# EAGLE schematic MEGA2560_Rev3e (EAGLE 9.3.0)

## Sheet 1 of 2
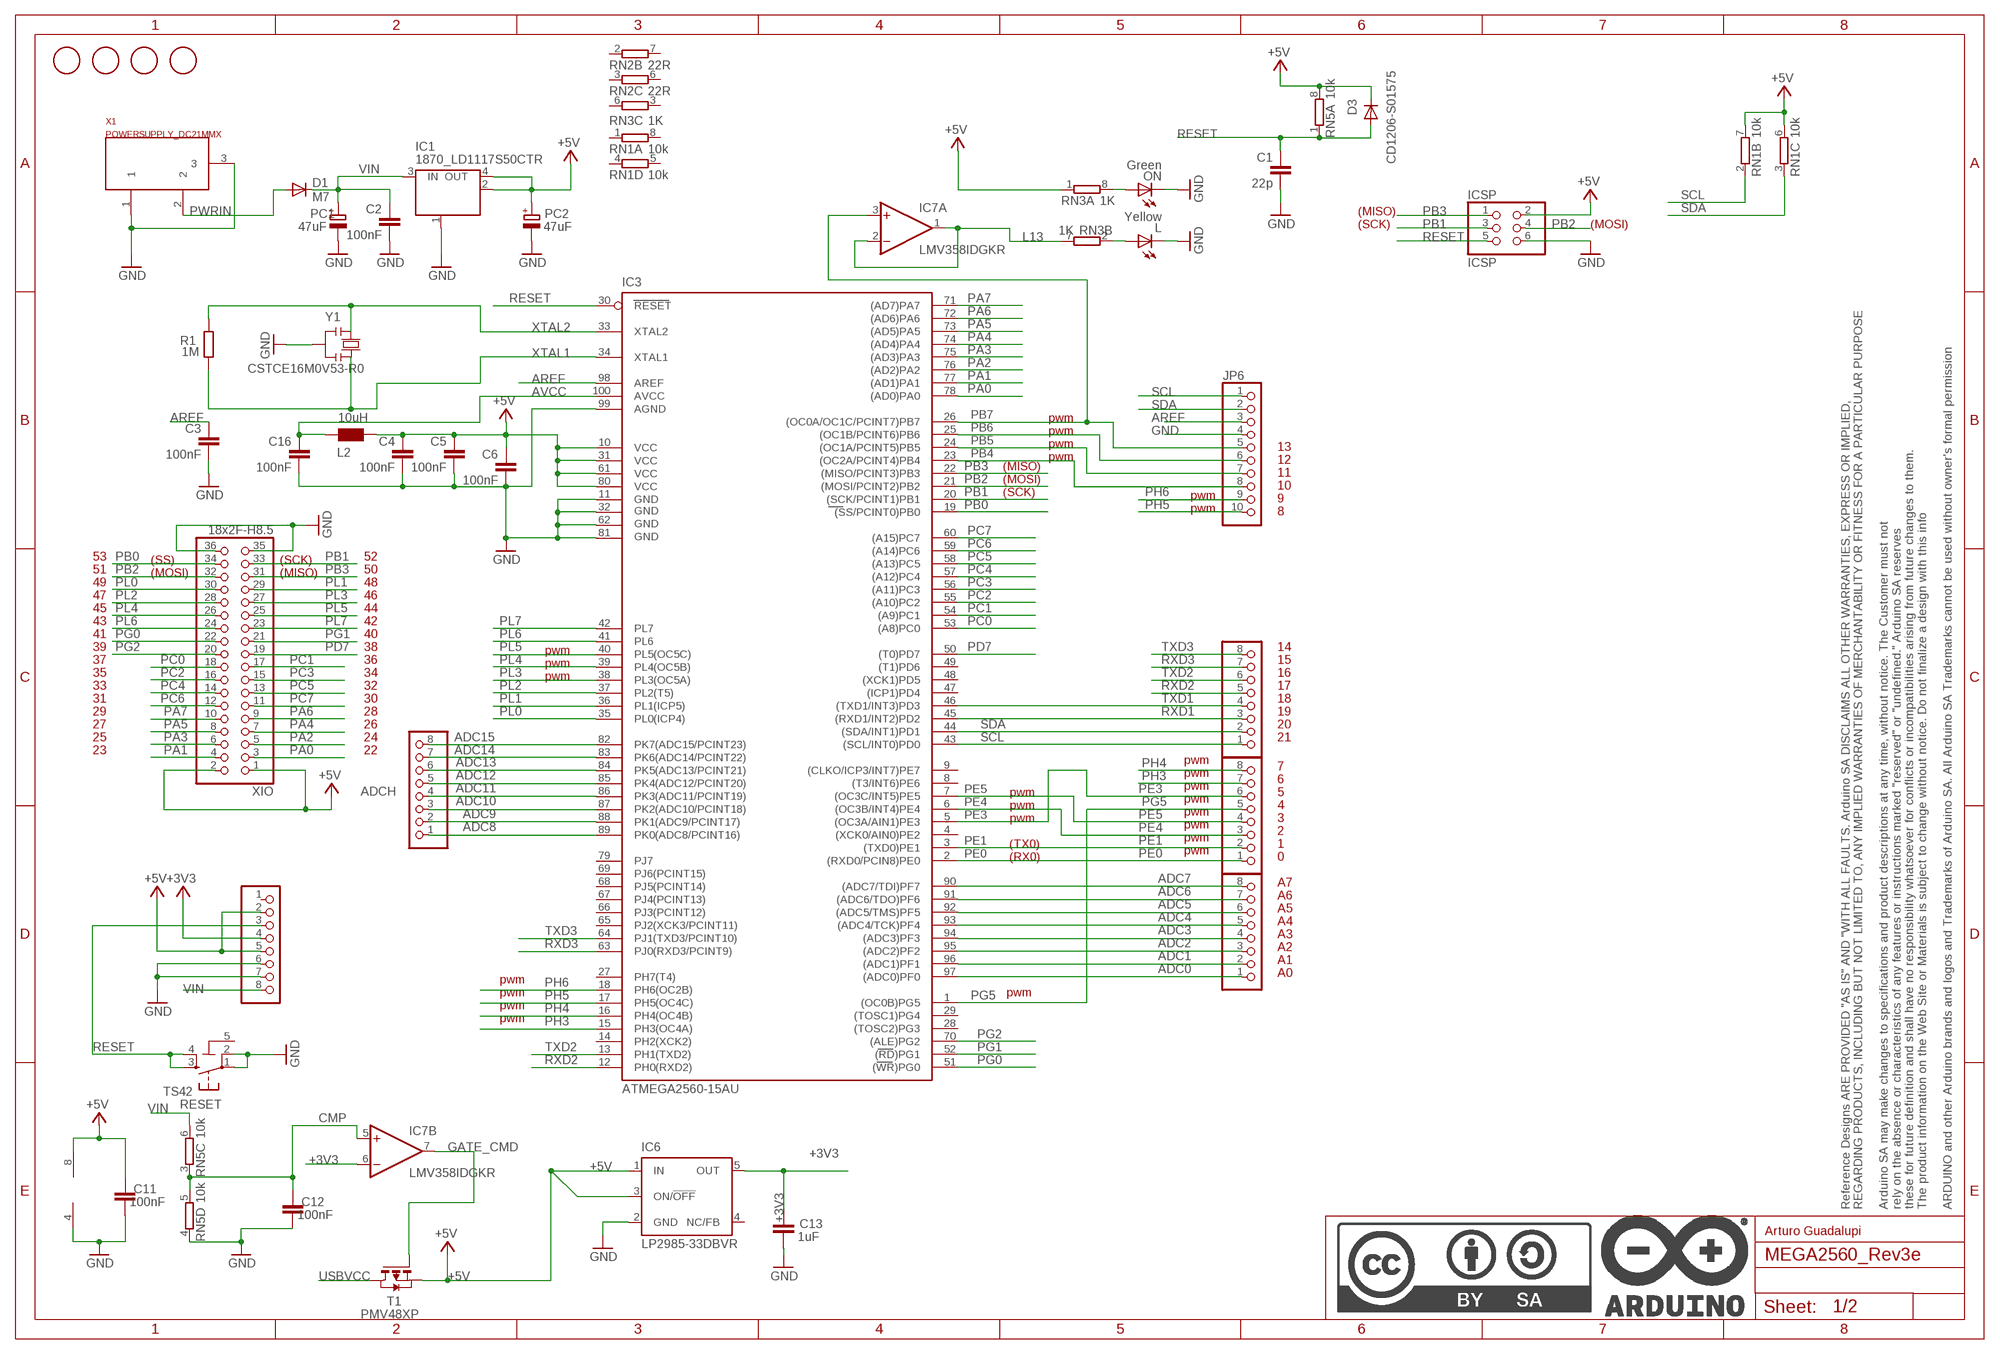
[diagram p0: schematic, sheet 1]

### Parts
ADCH  FH254-108DF08500V  0058_FH254-108DF08500V  [1X08]
ADCL  FH254-108DF08500V  0058_FH254-108DF08500V  [1X08]
C1  22p  0014_22PF_0603  [C0603-ROUND]
C2  100nF  0015_100NF_0603  [C0603-ROUND]
C3  100nF  0015_100NF_0603  [C0603-ROUND]
C4  100nF  0015_100NF_0603  [C0603-ROUND]
C5  100nF  0015_100NF_0603  [C0603-ROUND]
C6  100nF  0015_100NF_0603  [C0603-ROUND]
C11  100nF  0015_100NF_0603  [C0603-ROUND]
C12  100nF  0015_100NF_0603  [C0603-ROUND]
C13  1uF  0006_1UF_0603/GRM188R61E105KA12D  [C0603-ROUND]
C16  100nF  0015_100NF_0603  [C0603-ROUND]
COMMUNICATION  FH254-108DF08500V  0058_FH254-108DF08500V  [1X08]
D1  M7  0020_M7  [SMB]
D3  CD1206-S01575  0012_CD1206-S01575  [MINIMELF]
FD1  FIDUCIALMOUNT  [FIDUCIA-MOUNT]
FD2  FIDUCIALMOUNT  [FIDUCIA-MOUNT]
FD3  FIDUCIALMOUNT  [FIDUCIA-MOUNT]
FD4  FIDUCIALMOUNT  [FIDUCIA-MOUNT]
IC1  1870_LD1117S50CTR  [LINEAR_SOT223]
IC3  ATMEGA2560-15AU  0023_ATMEGA2560-16AU  [TQFP100]
IC6  LP2985-33DBVR  0008_TEXLP2985-33DBVR  [SOT23-DBV]
IC7  LMV358IDGKR  0021_LMV358IDGKR  [MSOP08]
ICSP  ICSP  0114_PH254-203DF118A00V  [2X03]
JP6  FH254-110DF08500V  1216_FH254-110DF08500T30  [1X10]
L  Yellow  0044_KPT-2012YC  [CHIPLED_0805]
L2  10uH  0715_CV201210-100K  [0805]
ON  Green  0043_KPT-2012SGC  [CHIPLED_0805]
PC1  47uF  0113_47UF  [PANASONIC_D]
PC2  47uF  0113_47UF  [PANASONIC_D]
POWER  FH254-108DF08500V  1217_FH254-108DF08500T21  [1X08]
PWML  FH254-108DF08500V  1218_FH254-108DF08500T20  [1X08]
R1  1M  0004_0603_1M  [R0603-ROUND]
RESET  TS42  0946_TS42031-160W-TR-7260  [TS42]
RN1  10k  0016_064R_10K_/_CAY16-103J4LF  [CAY16]
RN2  22R  0003_064R_22R_/_CAY16-220J4LF  [CAY16]
RN3  1K  0005_064R_1K_/_CAY16-102J4LF  [CAY16]
RN5  10k  0016_064R_10K_/_CAY16-103J4LF  [CAY16]
T1  PMV48XP  0297_PMV48XP  [SOT-23]
U$1  DNP  A3-FRAME  [FRAME]
X1  POWERSUPPLY_DC21MMX  [POWERSUPPLY_DC-21MM]
XIO  18x2F-H8.5  0060_FH254-218DF08500V  [2X18]
Y1  CSTCE16M0V53-R0  0011_CSTCE16M0V53-R0  [RESONATOR]

### Nets
+3V3 [power]: C13.2 IC6.5(OUT) IC7.6(B:-IN) POWER.4
+5V [power usb]: C4.1 C5.1 C6.1 C11.2 D3.C IC1.2(OUT) IC1.4(OUT) IC3.10(VCC) IC3.31(VCC1) IC3.61(VCC2) IC3.80(VCC3) IC6.1(IN) IC6.3(ON/!OFF) IC7.8(P:V+) ICSP.2 L2.2 PC2.+ POWER.2 POWER.5 RN1.6 RN1.7 RN3.1 RN5.8 T1.2(S) XIO.1 XIO.2 ; also sheet 2
ADC0: ADCL.1 IC3.97((ADC0)PF0)
ADC1: ADCL.2 IC3.96((ADC1)PF1)
ADC2: ADCL.3 IC3.95((ADC2)PF2)
ADC3: ADCL.4 IC3.94((ADC3)PF3)
ADC4: ADCL.5 IC3.93((ADC4/TCK)PF4)
ADC5: ADCL.6 IC3.92((ADC5/TMS)PF5)
ADC6: ADCL.7 IC3.91((ADC6/TDO)PF6)
ADC7: ADCL.8 IC3.90((ADC7/TDI)PF7)
ADC8: ADCH.1 IC3.89(PK0(ADC8/PCINT16))
ADC9: ADCH.2 IC3.88(PK1(ADC9/PCINT17))
ADC10: ADCH.3 IC3.87(PK2(ADC10/PCINT18))
ADC11: ADCH.4 IC3.86(PK3(ADC11/PCINT19))
ADC12: ADCH.5 IC3.85(PK4(ADC12/PCINT20))
ADC13: ADCH.6 IC3.84(PK5(ADC13/PCINT21))
ADC14: ADCH.7 IC3.83(PK6(ADC14/PCINT22))
ADC15: ADCH.8 IC3.82(PK7(ADC15/PCINT23))
AREF: C3.1 IC3.98(AREF) JP6.3
AVCC [power usb]: C16.1 IC3.100(AVCC) L2.1
CMP: C12.2 IC7.5(B:+IN) RN5.3 RN5.5
GATE_CMD: IC7.7(B:OUT) T1.3(G)
GND [gnd]: C1.2 C2.2 C3.2 C4.2 C5.2 C6.2 C11.1 C12.1 C13.1 C16.2 IC1.1(GND/ADJ) IC3.11(GND) IC3.32(GND1) IC3.62(GND2) IC3.81(GND3) IC3.99(AGND) IC6.2(GND) IC7.4(P:V-) ICSP.6 JP6.4 L.C ON.C PC1.- PC2.- POWER.6 POWER.7 RESET.1 RESET.2 RN5.4 X1.1 X1.3 XIO.35 XIO.36 Y1.2 ; also sheet 2
L13: IC7.1(A:OUT) IC7.2(A:-IN) RN3.7
N$2: L.A RN3.2
N$3: ON.A RN3.8
PA0: IC3.78((AD0)PA0) XIO.3
PA1: IC3.77((AD1)PA1) XIO.4
PA2: IC3.76((AD2)PA2) XIO.5
PA3: IC3.75((AD3)PA3) XIO.6
PA4: IC3.74((AD4)PA4) XIO.7
PA5: IC3.73((AD5)PA5) XIO.8
PA6: IC3.72((AD6)PA6) XIO.9
PA7: IC3.71((AD7)PA7) XIO.10
PB0: IC3.19((SS/PCINT0)PB0) XIO.34
PB1: IC3.20((SCK/PCINT1)PB1) ICSP.3 XIO.33
PB2: IC3.21((MOSI/PCINT2)PB2) ICSP.4 XIO.32
PB3: IC3.22((MISO/PCINT3)PB3) ICSP.1 XIO.31
PB4: IC3.23((OC2A/PCINT4)PB4) JP6.8
PB5: IC3.24((OC1A/PCINT5)PB5) JP6.7
PB6: IC3.25((OC1B/PCINT6)PB6) JP6.6
PB7: IC3.26((OC0A/OC1C/PCINT7)PB7) IC7.3(A:+IN) JP6.5
PC0: IC3.53((A8)PC0) XIO.18
PC1: IC3.54((A9)PC1) XIO.17
PC2: IC3.55((A10)PC2) XIO.16
PC3: IC3.56((A11)PC3) XIO.15
PC4: IC3.57((A12)PC4) XIO.14
PC5: IC3.58((A13)PC5) XIO.13
PC6: IC3.59((A14)PC6) XIO.12
PC7: IC3.60((A15)PC7) XIO.11
PD7: IC3.50((T0)PD7) XIO.19
PE0: IC3.2((RXD0/PCIN8)PE0) PWML.1 ; also sheet 2
PE1: IC3.3((TXD0)PE1) PWML.2 ; also sheet 2
PE3: IC3.5((OC3A/AIN1)PE3) PWML.6
PE4: IC3.6((OC3B/INT4)PE4) PWML.3
PE5: IC3.7((OC3C/INT5)PE5) PWML.4
PG0: IC3.51((WR)PG0) XIO.22
PG1: IC3.52((RD)PG1) XIO.21
PG2: IC3.70((ALE)PG2) XIO.20
PG5: IC3.1((OC0B)PG5) PWML.5
PH3: IC3.15(PH3(OC4A)) PWML.7
PH4: IC3.16(PH4(OC4B)) PWML.8
PH5: IC3.17(PH5(OC4C)) JP6.10
PH6: IC3.18(PH6(OC2B)) JP6.9
PL0: IC3.35(PL0(ICP4)) XIO.30
PL1: IC3.36(PL1(ICP5)) XIO.29
PL2: IC3.37(PL2(T5)) XIO.28
PL3: IC3.38(PL3(OC5A)) XIO.27
PL4: IC3.39(PL4(OC5B)) XIO.26
PL5: IC3.40(PL5(OC5C)) XIO.25
PL6: IC3.41(PL6) XIO.24
PL7: IC3.42(PL7) XIO.23
PWRIN [power]: D1.A X1.2
RESET: C1.1 D3.A IC3.30(RESET) ICSP.5 POWER.3 RESET.3 RESET.4 RN5.1 ; also sheet 2
RXD1: COMMUNICATION.3 IC3.45((RXD1/INT2)PD2)
RXD2: COMMUNICATION.5 IC3.12(PH0(RXD2))
RXD3: COMMUNICATION.7 IC3.63(PJ0(RXD3/PCINT9))
SCL: COMMUNICATION.1 IC3.43((SCL/INT0)PD0) JP6.1 RN1.2
SDA: COMMUNICATION.2 IC3.44((SDA/INT1)PD1) JP6.2 RN1.3
TXD1: COMMUNICATION.4 IC3.46((TXD1/INT3)PD3)
TXD2: COMMUNICATION.6 IC3.13(PH1(TXD2))
TXD3: COMMUNICATION.8 IC3.64(PJ1(TXD3/PCINT10))
USBVCC [power usb]: T1.1(D) ; also sheet 2
VIN [power]: C2.1 D1.C IC1.3(IN) PC1.+ POWER.8 RN5.6
XTAL1: IC3.34(XTAL1) R1.1 Y1.3
XTAL2: IC3.33(XTAL2) R1.2 Y1.1
Unconnected: IC3.4((XCK0/AIN0)PE2) IC3.8((T3/INT6)PE6) IC3.9((CLKO/ICP3/INT7)PE7) IC3.14(PH2(XCK2)) IC3.27(PH7(T4)) IC3.28((TOSC2)PG3) IC3.29((TOSC1)PG4) IC3.47((ICP1)PD4) IC3.48((XCK1)PD5) IC3.49((T1)PD6) IC3.65(PJ2(XCK3/PCINT11)) IC3.66(PJ3(PCINT12)) IC3.67(PJ4(PCINT13)) IC3.68(PJ5(PCINT14)) IC3.69(PJ6(PCINT15)) IC3.79(PJ7) IC6.4(NC/FB) POWER.1 RN1.1 RN1.4 RN1.5 RN1.8 RN2.2 RN2.3 RN2.6 RN2.7 RN3.3 RN3.6

### Notes on the sheet
- (MISO)
- (SCK) | (MOSI)
- pwm
- pwm
- pwm | 13
- pwm | 12
- (MISO)
- 11
- (MOSI)
- 10
- (SCK) | pwm
- 9
- pwm | 8
- 53 | (SS) | (SCK) | 52
- 51 | (MOSI) | (MISO) | 50
- 49 | 48
- 47 | 46
- 45 | 44
- 43 | 42
- 41 | 40
- 39 | 38 | pwm | 14
- 37 | 36 | pwm | 15
- 35 | 34 | pwm | 16
- 33 | 32 | 17
- 31 | 30 | 18
- 29 | 28 | 19
- 27 | 26 | 20
- 25 | 24 | 21
- 23 | 22
- pwm
- 7
- pwm
- 6
- pwm
- pwm | 5
- pwm
- pwm | 4
- pwm
- pwm | 3
- pwm
- 2
- pwm
- (TX0) | 1
- pwm
- (RX0) | 0
- A7
- A6
- A5
- A4
- A3
- A2
- A1
- A0
- pwm
- pwm | pwm
- pwm
- pwm
- Arturo Guadalupi

## Sheet 2 of 2
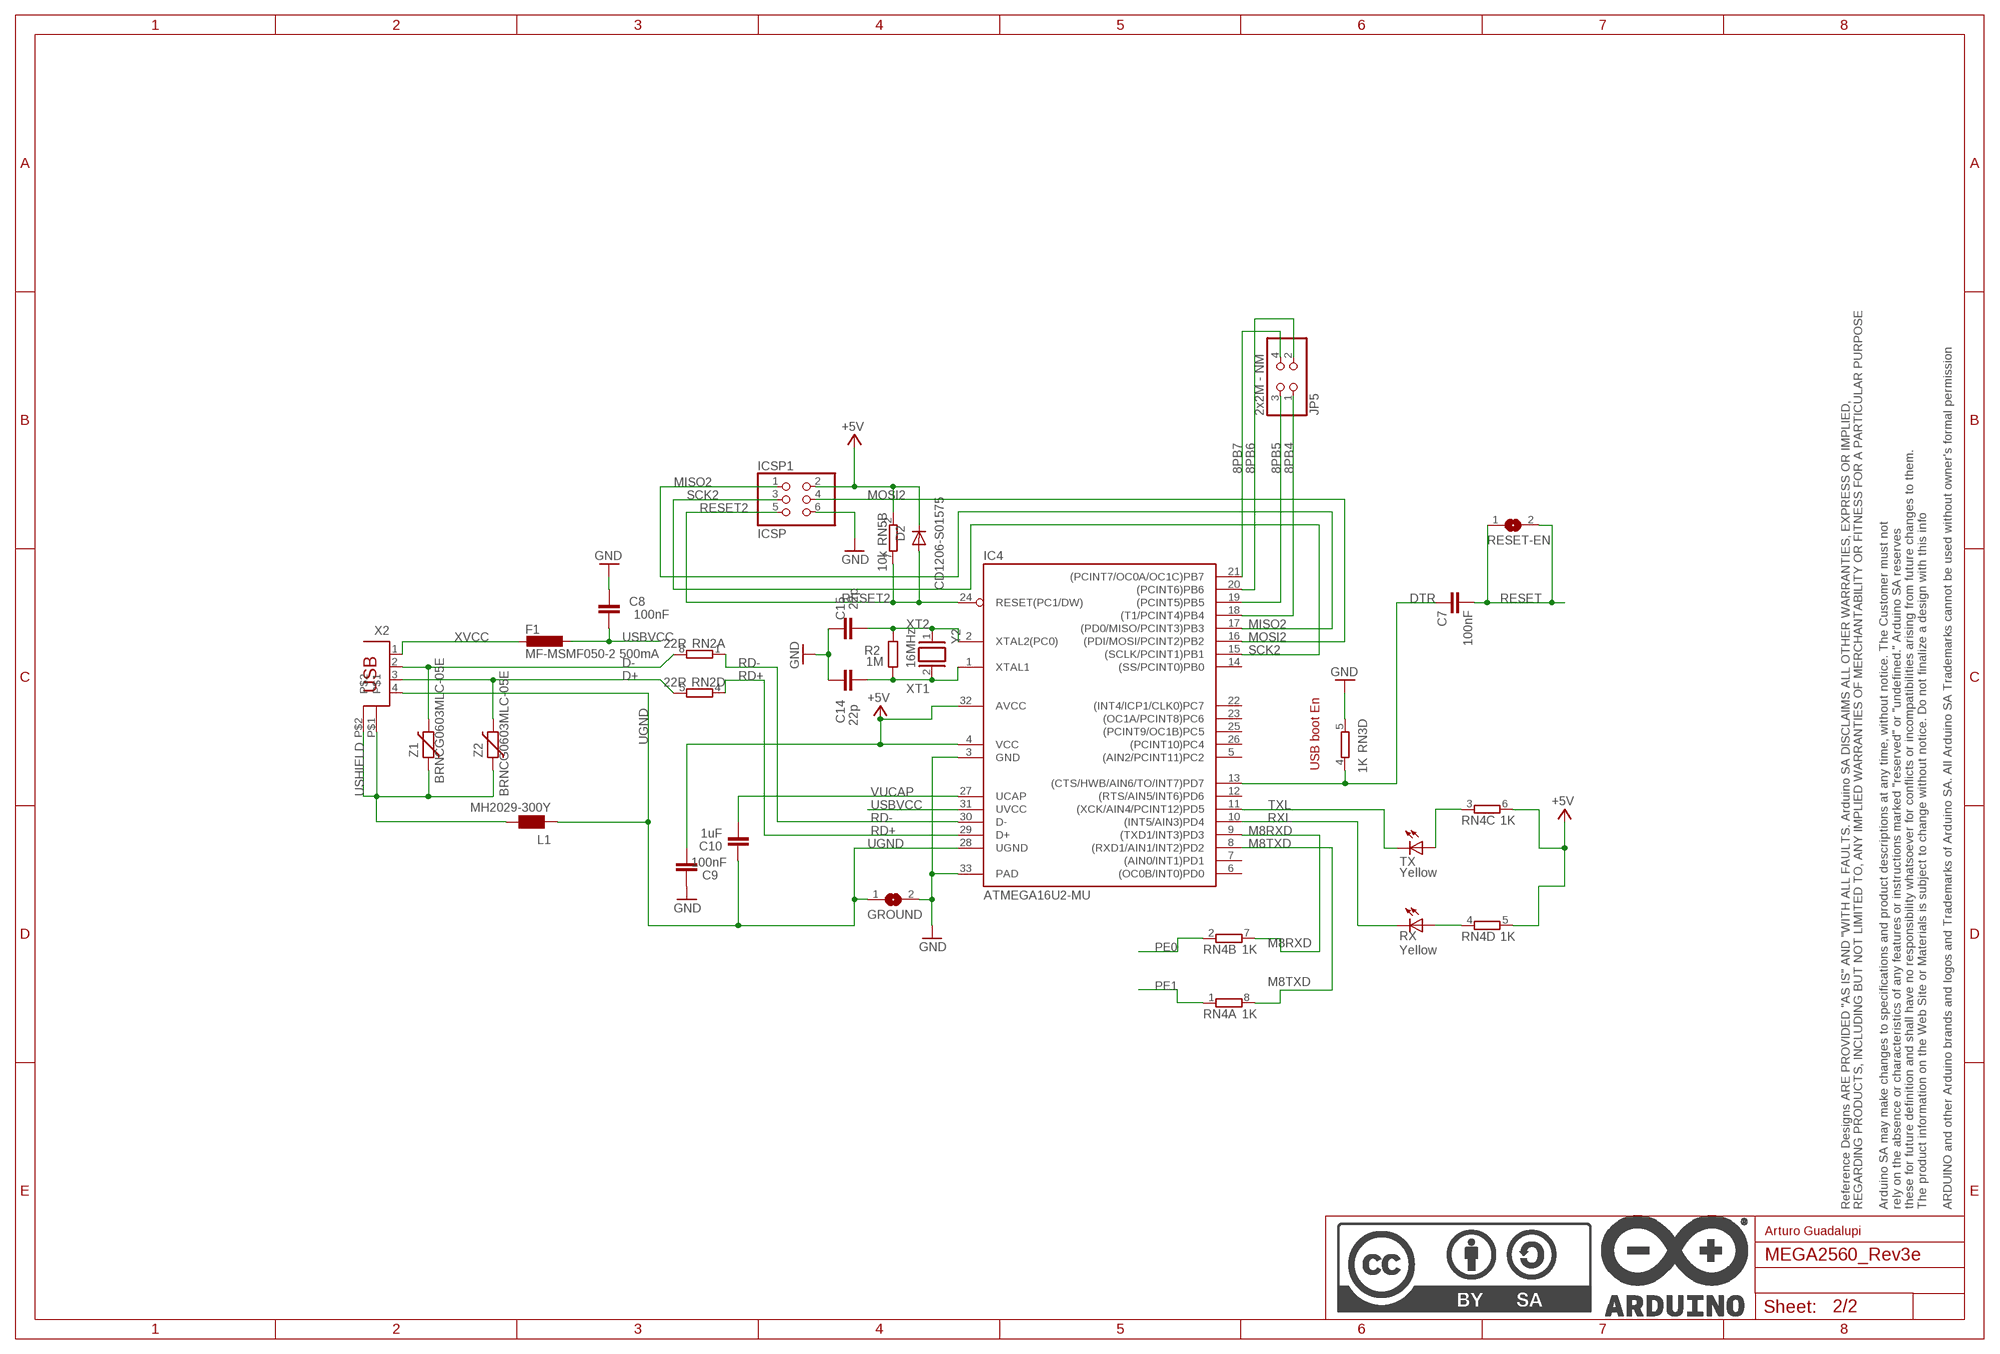
[diagram p1: schematic, sheet 2]

### Parts
C7  100nF  0015_100NF_0603  [C0603-ROUND]
C8  100nF  0015_100NF_0603  [C0603-ROUND]
C9  100nF  0015_100NF_0603  [C0603-ROUND]
C10  1uF  0006_1UF_0603/GRM188R61E105KA12D  [C0603-ROUND]
C14  22p  0014_22PF_0603  [C0603-ROUND]
C15  22p  0014_22PF_0603  [C0603-ROUND]
D2  CD1206-S01575  0012_CD1206-S01575  [MINIMELF]
F1  MF-MSMF050-2 500mA  0002_MF-MSMF050-2  [L1812]
GROUND  SJ  [SJ]
IC4  ATMEGA16U2-MU  0007_ATMEGA16U2-MUR  [MLF32]
ICSP1  ICSP  0114_PH254-203DF118A00V  [2X03]
JP5  2x2M - NM  PINHD-2X2  [2X02]
L1  MH2029-300Y  0001_BLM21PG300SN1D_/_MH2029-300Y  [0805]
R2  1M  0004_0603_1M  [R0603-ROUND]
RESET-EN  SJ  [SJ]
RN4  1K  0005_064R_1K_/_CAY16-102J4LF  [CAY16]
RX  Yellow  0044_KPT-2012YC  [CHIPLED_0805]
TX  Yellow  0044_KPT-2012YC  [CHIPLED_0805]
U$2  DNP  A3-FRAME  [FRAME]
X2  0056_USB-B-S-RA-WT-SPCC  [PN61729]
Y2  16MHz  0019_P011052006_16M  [QS]
Z1  BRNCG0603MLC-05E  0010_BRNCG0603MLC-05E  [CT/CN0603]
Z2  BRNCG0603MLC-05E  0010_BRNCG0603MLC-05E  [CT/CN0603]

### Nets
8PB4: IC4.18((T1/PCINT4)PB4) JP5.1
8PB5: IC4.19((PCINT5)PB5) JP5.3
8PB6: IC4.20((PCINT6)PB6) JP5.2
8PB7: IC4.21((PCINT7/OC0A/OC1C)PB7) JP5.4
+5V [power usb]: C9.1 D2.C IC4.4(VCC) IC4.32(AVCC) ICSP1.2 RN4.5 RN4.6 RN5.2 ; also sheet 1
D+: RN2.5 X2.3 Z2.2
D-: RN2.8 X2.2 Z1.2
DTR: C7.1 IC4.13((CTS/HWB/AIN6/TO/INT7)PD7) RN3.4
GND [gnd]: C8.2 C9.2 C14.2 C15.2 GROUND.2 IC4.3(GND) IC4.33(PAD) ICSP1.6 RN3.5 ; also sheet 1
M8RXD: IC4.9((TXD1/INT3)PD3) RN4.7
M8TXD: IC4.8((RXD1/AIN1/INT2)PD2) RN4.8
MISO2: IC4.17((PD0/MISO/PCINT3)PB3) ICSP1.1
MOSI2: IC4.16((PDI/MOSI/PCINT2)PB2) ICSP1.4
N$54: RN4.4 RX.A
N$55: RN4.3 TX.A
PE0: RN4.2 ; also sheet 1
PE1: RN4.1 ; also sheet 1
RD+: IC4.29(D+) RN2.4
RD-: IC4.30(D-) RN2.1
RESET: C7.2 RESET-EN.1 RESET-EN.2 ; also sheet 1
RESET2: D2.A IC4.24(RESET(PC1/DW)) ICSP1.5 RN5.7
RXL: IC4.10((INT5/AIN3)PD4) RX.C
SCK2: IC4.15((SCLK/PCINT1)PB1) ICSP1.3
TXL: IC4.11((XCK/AIN4/PCINT12)PD5) TX.C
UGND [gnd]: C10.2 GROUND.1 IC4.28(UGND) L1.1 X2.4
USBVCC [power usb]: C8.1 F1.1 IC4.31(UVCC) ; also sheet 1
USHIELD [gnd]: L1.2 X2.P$1 X2.P$2 Z1.1 Z2.1
VUCAP: C10.1 IC4.27(UCAP)
XT1: C14.1 IC4.1(XTAL1) R2.1 Y2.2
XT2: C15.1 IC4.2(XTAL2(PC0)) R2.2 Y2.1
XVCC [power usb]: F1.2 X2.1
Unconnected: IC4.5((AIN2/PCINT11)PC2) IC4.6((OC0B/INT0)PD0) IC4.7((AIN0/INT1)PD1) IC4.12((RTS/AIN5/INT6)PD6) IC4.14((SS/PCINT0)PB0) IC4.22((INT4/ICP1/CLK0)PC7) IC4.23((OC1A/PCINT8)PC6) IC4.25((PCINT9/OC1B)PC5) IC4.26((PCINT10)PC4)

### Notes on the sheet
- USB boot En
- Arturo Guadalupi

## Power pins joined to a net without a drawn wire
5-GND: RESET.5(5-GND)

## Library data of the parts
ADCH ADCL COMMUNICATION = Connettori:0058_FH254-108DF08500V: Female Connector strip for Arduino bases - 8x1 F V h 8,5 p2,54mm; MONTHLY_USAGE: _____; PART_NUMBER: FH254-108DF08500V; PRICE: _____; SUPPLIER: _____; TYPE: Connettori
C1 C14 C15 = Condensatori:0014_22PF_0603: 22pF 0603; CASE: 0603; MONTHLY_USAGE: _____; PART_NUMBER: 22pF_0603; PRICE: _____; SUPPLIER: _____; TYPE: Condensatori
C2-C9 C11 C12 C16 = Condensatori:0015_100NF_0603: 100nF 0603 50V; CASE: 0603; MONTHLY_USAGE: _____; PART_NUMBER: cl10b104kbnc; PRICE: _____; SUPPLIER: _____; TYPE: Condensatori
C10 C13 = Condensatori:0006_1UF_0603/GRM188R61E105KA12D: 1uF 0603; CASE: 0603; MONTHLY_USAGE: _____; PART_NUMBER: 1uF_0603/GRM188R61E105KA12D; PRICE: _____; SUPPLIER: _____; TYPE: Condensatori
D1 = Diodi:0020_M7: 1.0A 40V SURFACE MOUNT GLASS PASSIVATED RECTIFIER M7; CASE: SMA; MONTHLY_USAGE: _____; PART_NUMBER: M7; PRICE: _____; SUPPLIER: _____; TYPE: Diodi
D2 D3 = Diodi:0012_CD1206-S01575: small-signal high-speed Switching Diodes CD1206; CASE: 1206; MONTHLY_USAGE: _____; PART_NUMBER: CD1206-S01575; PRICE: _____; SUPPLIER: _____; TYPE: Diodi
F1 = Protezione:0002_MF-MSMF050-2: 500 mA Multifuse � Polyfuse; MONTHLY_USAGE: _____; PART_NUMBER: MF-MSMF050-2; PRICE: _____; SUPPLIER: _____; TYPE: Protezione
FD1-FD4 = SmartPrj:FIDUCIALMOUNT
GROUND RESET-EN = jumper:SJ: SMD solder JUMPER
IC1 = IntegratedCircuits:1870_LD1117S50CTR: Low-dropout linear regulator 5V -LM1117IMPX-5.0; CASE: SOT223; MONTHLY_USAGE: _____; PART_NUMBER: LD1117S50CTR; PRICE: _____; SUPPLIER: _____; TYPE: Circuito_Integrato; VALUE: LD1117S50CTR
IC3 = IntegratedCircuits:0023_ATMEGA2560-16AU: 8-bit Microcontroller with 256K Bytes In-System Programmable Flash - ATMEGA2560-16AU; CASE: TQFP100_14x14; MONTHLY_USAGE: _____; PART_NUMBER: ATMEGA2560-16AU; PRICE: _____; SUPPLIER: _____; TYPE: Circuito_Integrato
IC4 = IntegratedCircuits:0007_ATMEGA16U2-MUR: 8-bit Microcontroller with 16K Bytes of ISP Flash and USB Controller ATMEGA16U2-MUR; CASE: QFN32_5x5; MONTHLY_USAGE: _____; PART_NUMBER: ATMEGA16U2-MUR; PRICE: _____; SUPPLIER: _____; TYPE: Circuito_Integrato
IC6 = IntegratedCircuits:0008_TEXLP2985-33DBVR: 150-mA LOW-NOISE LOW-DROPOUT REGULATOR WITH SHUTDOWN LP2985-33DBVR; CASE: SOT23-5; MONTHLY_USAGE: _____; PART_NUMBER: TEXLP2985-33DBVR; PRICE: _____; SUPPLIER: _____; TYPE: Circuito_Integrato
IC7 = IntegratedCircuits:0021_LMV358IDGKR: Dual low-voltage (2.7 V to 5.5 V), operational amplifiers with rail-to-rail output swing LMV358IDGKR; CASE: MSOP8; MONTHLY_USAGE: _____; PART_NUMBER: LMV358IDGKR; PRICE: _____; SUPPLIER: _____; TYPE: Circuito_Integrato
ICSP ICSP1 = Connettori:0114_PH254-203DF118A00V: 3x2 M V h 8,5 mm p2,54; MONTHLY_USAGE: _____; PART_NUMBER: PH254-203DF118A00V; PRICE: _____; SUPPLIER: _____; TYPE: Connettori
JP5 = SmartPrj:PINHD-2X2: PIN HEADER
JP6 = Connettori:1216_FH254-110DF08500T30: Female Connector strip for Arduino bases - 10x1 F V h 8,5 p2,54 serigrafato STRISCIA VUOTA; MONTHLY_USAGE: _____; PART_NUMBER: FH254-110DF08500T30; PRICE: _____; SUPPLIER: _____; TYPE: Connettori; VALUE: FH254-110DF08500T30
L RX TX = Opto:0044_KPT-2012YC: LED YELLOW - SMD - 0805; MONTHLY_USAGE: _____; PART_NUMBER: KPT-2012YC; PRICE: _____; SUPPLIER: _____; TYPE: Opto
L1 = Protezione:0001_BLM21PG300SN1D_/_MH2029-300Y: BLM21; MONTHLY_USAGE: _____; PART_NUMBER: BLM21PG300SN1D_/_MH2029-300Y; PRICE: _____; SUPPLIER: _____; TYPE: Protezione
L2 = Induttanze:0715_CV201210-100K: 10uH 0805; CASE: 0805; MONTHLY_USAGE: _____; PART_NUMBER: CV201210-100K; PRICE: _____; SUPPLIER: _____; TYPE: Induttanze
ON = Opto:0043_KPT-2012SGC: LED GREEN - SMD-0805; MONTHLY_USAGE: _____; PART_NUMBER: KPT-2012SGC; PRICE: _____; SUPPLIER: _____; TYPE: Opto
PC1 PC2 = Condensatori:0113_47UF: 47uF; MONTHLY_USAGE: _____; PART_NUMBER: 47uF; PRICE: _____; SUPPLIER: _____; TYPE: Condensatori
POWER = Connettori:1217_FH254-108DF08500T21: Female Connector strip for Arduino bases - 8x1 F V h 8,5 p2,54 serigrafato POWER; MONTHLY_USAGE: _____; PART_NUMBER: FH254-108DF08500T21; PRICE: _____; SUPPLIER: _____; TYPE: Connettori; VALUE: FH254-108DF08500T21
PWML = Connettori:1218_FH254-108DF08500T20: Female Connector strip for Arduino bases - 8x1 F V h 8,5 p2,54 serigrafato DIGITAL; MONTHLY_USAGE: _____; PART_NUMBER: FH254-108DF08500T20; PRICE: _____; SUPPLIER: _____; TYPE: Connettori; VALUE: FH254-108DF08500T20
R1 R2 = Resistenze:0004_0603_1M: 1M 0603; CASE: 0603; MONTHLY_USAGE: _____; PART_NUMBER: 0603_1M; PRICE: _____; SUPPLIER: _____; TYPE: Resistenze
RESET = Switches:0946_TS42031-160W-TR-7260: Pushbutton 6x6 Smd - White; MONTHLY_USAGE: _____; PART_NUMBER: IT-1157AHNP-160G-G_GTR; PRICE: _____; SUPPLIER: _____; TYPE: Switches
RN1 RN5 = Resistenze:0016_064R_10K_/_CAY16-103J4LF: 10K 064 R; CASE: SMD_3,2x1,6; MONTHLY_USAGE: _____; PART_NUMBER: 064R_10K_/_CAY16-103J4LF; PRICE: _____; SUPPLIER: _____; TYPE: Resistenze
RN2 = Resistenze:0003_064R_22R_/_CAY16-220J4LF: 22R 064R; CASE: SMD_3,2x1,6; MONTHLY_USAGE: _____; PART_NUMBER: 064R_22R_/_CAY16-220J4LF; PRICE: _____; SUPPLIER: _____; TYPE: Resistenze
RN3 RN4 = Resistenze:0005_064R_1K_/_CAY16-102J4LF: 1K 064R; CASE: SMD_3,2x1,6; MONTHLY_USAGE: _____; PART_NUMBER: 064R_1K_/_CAY16-102J4LF; PRICE: _____; SUPPLIER: _____; TYPE: Resistenze
T1 = Transistors:0297_PMV48XP: 20 V, 3.5 A P-channel Trench MOSFET - PMV48XP; CASE: SOT23; MONTHLY_USAGE: _____; PART_NUMBER: PMV48XP; PRICE: _____; SUPPLIER: _____; TYPE: Transistor
U$1 U$2 = Arduino-utility:A3-FRAME; CODE-ARDUINO: DNP; DATASHEET: DNP; DISTRIBUTOR-LINK: DNP; DISTRIBUTOR-PN: DNP; MANUFACTURER: DNP; MANUFACTURER-PN: DNP; NOTE: DNP
X1 = SmartPrj:POWERSUPPLY_DC21MM
X2 = Connettori:0056_USB-B-S-RA-WT-SPCC: USB - B; MONTHLY_USAGE: _____; PART_NUMBER: USB-B-S-RA-WT-SPCC; PRICE: _____; SUPPLIER: _____; TYPE: Connettori
XIO = Connettori:0060_FH254-218DF08500V: 18x2 F V h 8,5 p2,54; MONTHLY_USAGE: _____; PART_NUMBER: FH254-218DF08500V; PRICE: _____; SUPPLIER: _____; TYPE: Connettori
Y1 = Cristalli:0011_CSTCE16M0V53-R0: 16Mhz - SMD; MONTHLY_USAGE: _____; PART_NUMBER: CSTCE16M0V53-R0; PRICE: _____; SUPPLIER: _____; TYPE: Cristalli
Y2 = Cristalli:0019_P011052006_16M: 16MHz THT; PART_NUMBER: P011052006 16M/FTX16M20S; TYPE: Cristalli
Z1 Z2 = Protezione:0010_BRNCG0603MLC-05E: CG0603MLC-05E; MONTHLY_USAGE: _____; PART_NUMBER: BRNCG0603MLC-05E; PRICE: _____; SUPPLIER: _____; TYPE: Protezione

## Net classes
0 default: width 0.203 mm, drill 0.406 mm, clearance 0.203 mm
1 power: width 0.61 mm, drill 0.406 mm, clearance 0.203 mm
2 gnd: width 0.305 mm, drill 0.406 mm, clearance 0.203 mm
3 power usb: width 0.508 mm, drill 0.406 mm, clearance 0.203 mm